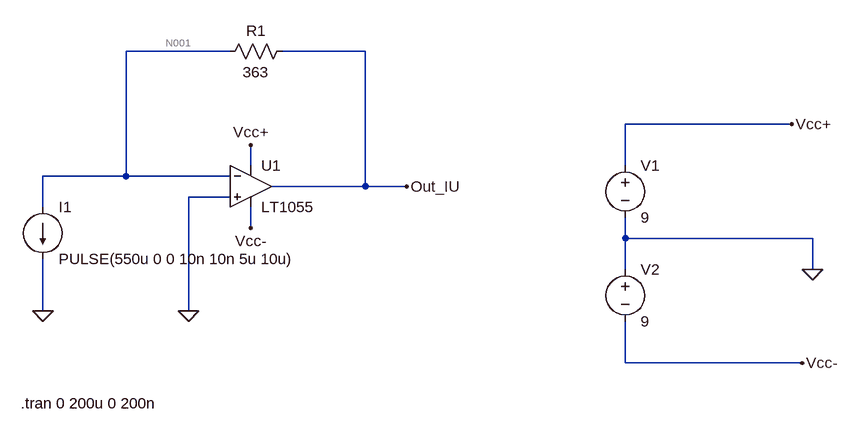
[diagram p0: schematic Cablage2.asc]
Cablage2.asc, the LTspice schematic file:
Version 4
SHEET 1 1100 680
WIRE 128 -464 -32 -464
WIRE 336 -464 208 -464
WIRE 992 -352 736 -352
WIRE 160 -288 160 -320
WIRE 736 -288 736 -352
WIRE -32 -272 -32 -464
WIRE -32 -272 -160 -272
WIRE 128 -272 -32 -272
WIRE 336 -256 336 -464
WIRE 336 -256 192 -256
WIRE 400 -256 336 -256
WIRE 128 -240 64 -240
WIRE -160 -224 -160 -272
WIRE 160 -192 160 -224
WIRE 736 -176 736 -208
WIRE 1024 -176 736 -176
WIRE 736 -128 736 -176
WIRE 1024 -128 1024 -176
WIRE -160 -64 -160 -144
WIRE 64 -64 64 -240
WIRE 736 16 736 -48
WIRE 1008 16 736 16
FLAG 64 -64 0
FLAG -160 -64 0
FLAG 1024 -128 0
FLAG 992 -352 Vcc+
FLAG 1008 16 Vcc-
FLAG 400 -256 Out_IU
FLAG 160 -320 Vcc+
FLAG 160 -192 Vcc-
SYMBOL OpAmps\\LT1055 160 -320 R0
SYMATTR InstName U1
SYMBOL current -160 -224 R0
WINDOW 123 0 0 Left 0
WINDOW 39 0 0 Left 0
SYMATTR InstName I1
SYMATTR Value PULSE(550u 0 0 10n 10n 5u 10u)
SYMBOL voltage 736 -304 R0
WINDOW 123 0 0 Left 0
WINDOW 39 0 0 Left 0
SYMATTR InstName V1
SYMATTR Value 9
SYMBOL voltage 736 -144 R0
WINDOW 123 0 0 Left 0
WINDOW 39 0 0 Left 0
SYMATTR InstName V2
SYMATTR Value 9
SYMBOL res 112 -448 R270
WINDOW 0 32 56 VTop 2
WINDOW 3 0 56 VBottom 2
SYMATTR InstName R1
SYMATTR Value 363
SYMATTR SpiceLine tol=1 pwr=0.1
TEXT -194 78 Left 2 !.tran 0 200u 0 200n

The netlist it stands for:
* Cablage2.asc
XU1 0 N001 Vcc+ Vcc- Out_IU LT1055  ; pins In+ In- V+ V- OUT
I1 N001 0 PULSE(550u 0 0 10n 10n 5u 10u)
V1 Vcc+ 0 9
V2 0 Vcc- 9
R1 N001 Out_IU 363 tol=1 pwr=0.1
.tran 0 200u 0 200n
.backanno
.end

* Results of the author's LTspice run, read from the files saved beside the schematic
* Operating Point, zero values left out:
*   V(n001) = -537.3 nV
*   V(vcc+) = 9 V
*   V(vcc-) = -9 V
*   V(out_iu) = 199.6 mV
*   I(I1) = 550 µA
*   I(R1) = -550 µA
*   I(V2) = -2.532 mA
*   I(V1) = -3.082 mA
*   Ix(u1:3) = 3.082 mA
*   Ix(u1:4) = -2.532 mA
*   Ix(u1:5) = -550 µA
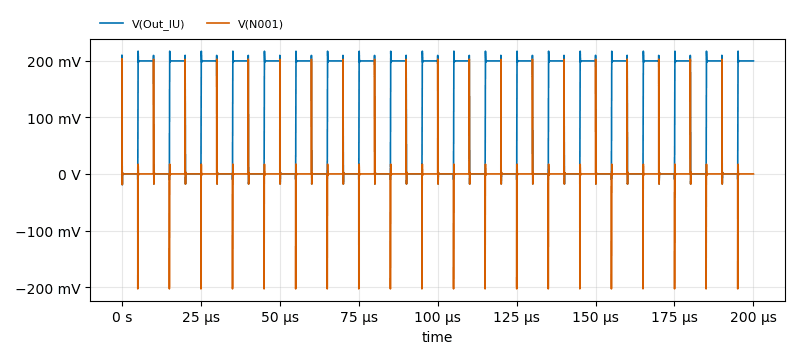
[diagram p1: Transient Analysis of Cablage2.asc, plotted from the saved traces]
* Transient Analysis, 1 run:
*   V(Out_IU): min -19.05 mV, max 216.8 mV, average 99.59 mV, rms 140.9 mV, last 199.6 mV
*   V(N001): min -203 mV, max 203.4 mV, average -39.69 µV, rms 16.04 mV, last -539.9 nV